# EAGLE design Itchycoo Tape Flanger (EAGLE 9.5.2)

## Sheet 1 of 3
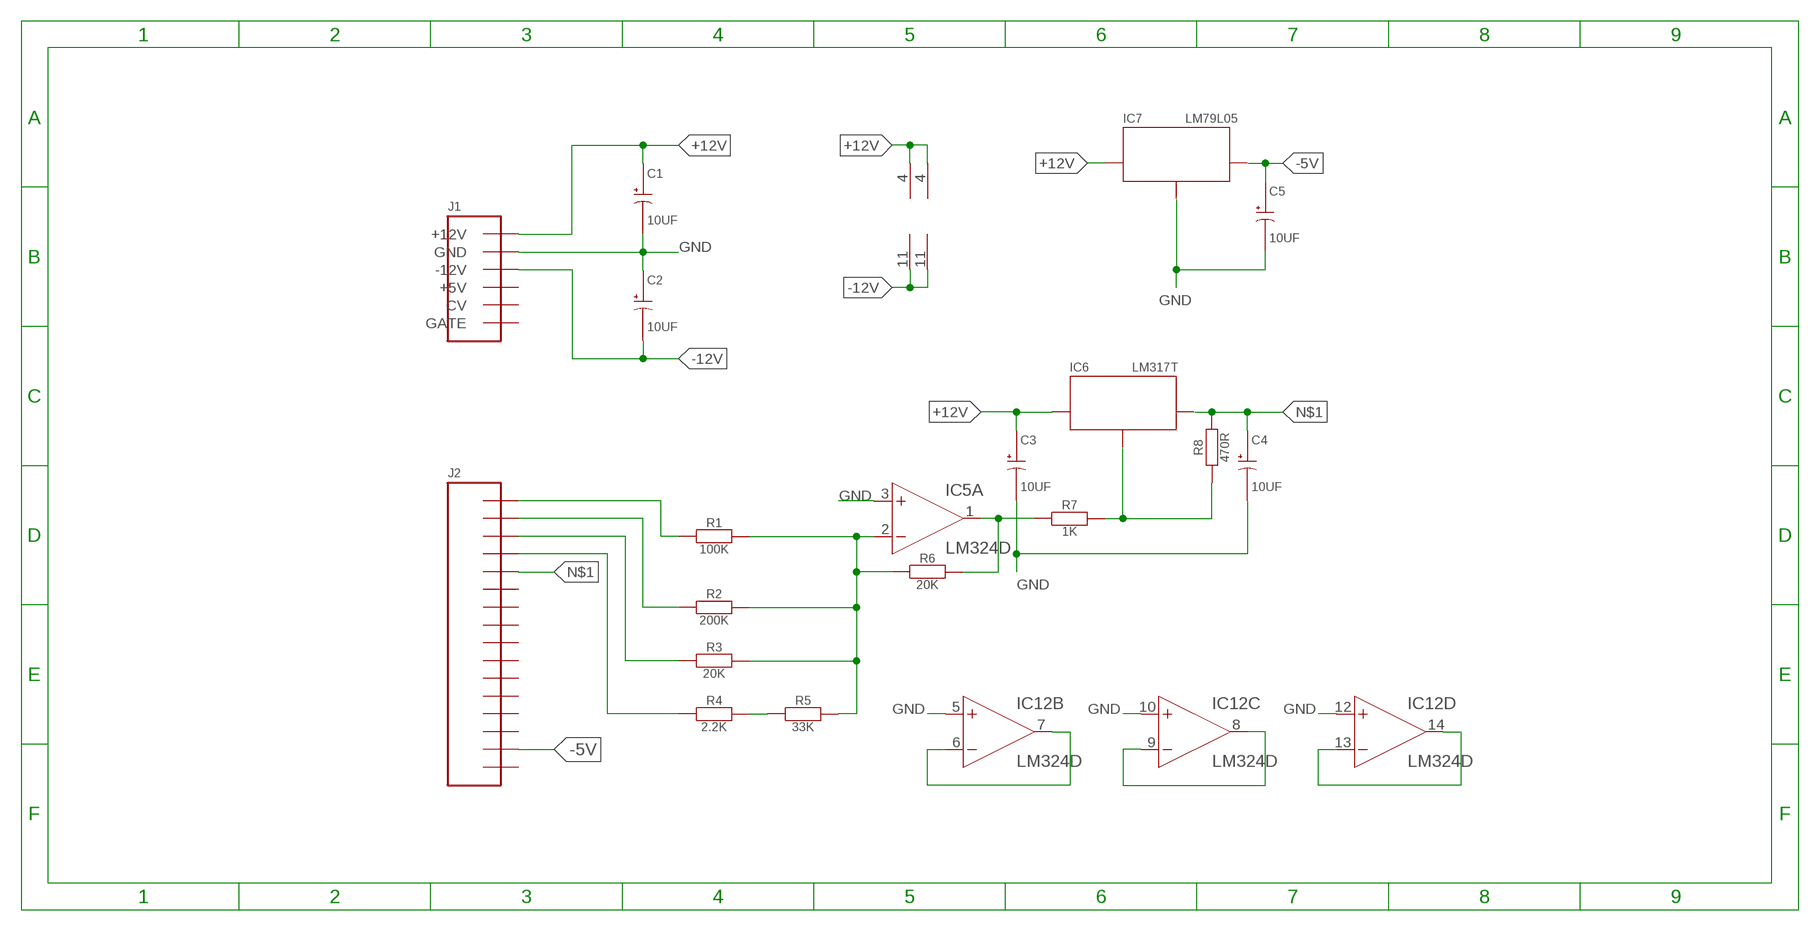
[diagram p0: schematic, sheet 1]

### Parts
C1  10UF  C+  [PANASONIC_E]
C2  10UF  C+  [PANASONIC_E]
C3  10UF  C+  [PANASONIC_E]
C4  10UF  C+  [PANASONIC_E]
C5  10UF  C+  [PANASONIC_E]
IC5  LM324D  [SO14]
IC6  LM317T  VREG  [SOIC8]
IC7  LM79L05  VREG  [SOIC8]
IC12  LM324D  [SO14]
J1  EURO  [2X08SMT]
J2  CON_16  [2X08SMT]
R1  100K  R  [R6332W]
R2  200K  R  [R6332W]
R3  20K  R  [R6332W]
R4  2.2K  R  [R6332W]
R5  33K  R  [R6332W]
R6  20K  R  [R6332W]
R7  1K  R  [R6332W]
R8  470R  R  [R6332W]

### Nets
+12V: C1.+ C3.+ IC5.4(P:V+) IC6.8(IN) IC7.8(IN) IC12.4(P:V+) J1.9(+12V) J1.10(+12V) ; also sheet 2,3
-5V: C5.+ IC7.1(OUT) J2.15
-12V: C2.- IC5.11(P:V-) IC12.11(P:V-) J1.1(-12V) J1.2(-12V) ; also sheet 2,3
GND: C1.- C2.+ C3.- C4.- C5.- IC5.3(A:+IN) IC7.2(GND) IC7.3(GND) IC7.6(GND) IC7.7(GND) IC12.5(B:+IN) IC12.10(C:+IN) IC12.12(D:+IN) J1.3(GND) J1.4(GND) J1.5(GND) J1.6(GND) J1.7(GND) J1.8(GND) ; also sheet 2,3
N$1: C4.+ IC6.1(OUT) J2.5 R8.2
N$3: J2.4 R4.1
N$4: J2.3 R3.1
N$5: R4.2 R5.1
N$6: IC5.2(A:-IN) R1.2 R2.2 R3.2 R5.2 R6.1
N$8: IC5.1(A:OUT) R6.2 R7.1
N$10: IC6.2(GND) IC6.3(GND) IC6.6(GND) IC6.7(GND) R7.2 R8.1
N$13: IC12.8(C:OUT) IC12.9(C:-IN)
N$19: J2.2 R2.1
N$20: IC12.6(B:-IN) IC12.7(B:OUT)
N$23: IC12.13(D:-IN) IC12.14(D:OUT)
N$27: J2.1 R1.1
Unconnected: IC5.5(B:+IN) IC5.6(B:-IN) IC5.7(B:OUT) IC5.8(C:OUT) IC5.9(C:-IN) IC5.10(C:+IN) IC5.12(D:+IN) IC5.13(D:-IN) IC5.14(D:OUT) IC12.1(A:OUT) IC12.2(A:-IN) IC12.3(A:+IN) J1.11(+5V) J1.12(+5V) J1.13(CV) J1.14(CV) J1.15(GATE) J1.16(GATE) J2.6 J2.7 J2.8 J2.9 J2.10 J2.11 J2.12 J2.13 J2.14 J2.16

## Sheet 2 of 3
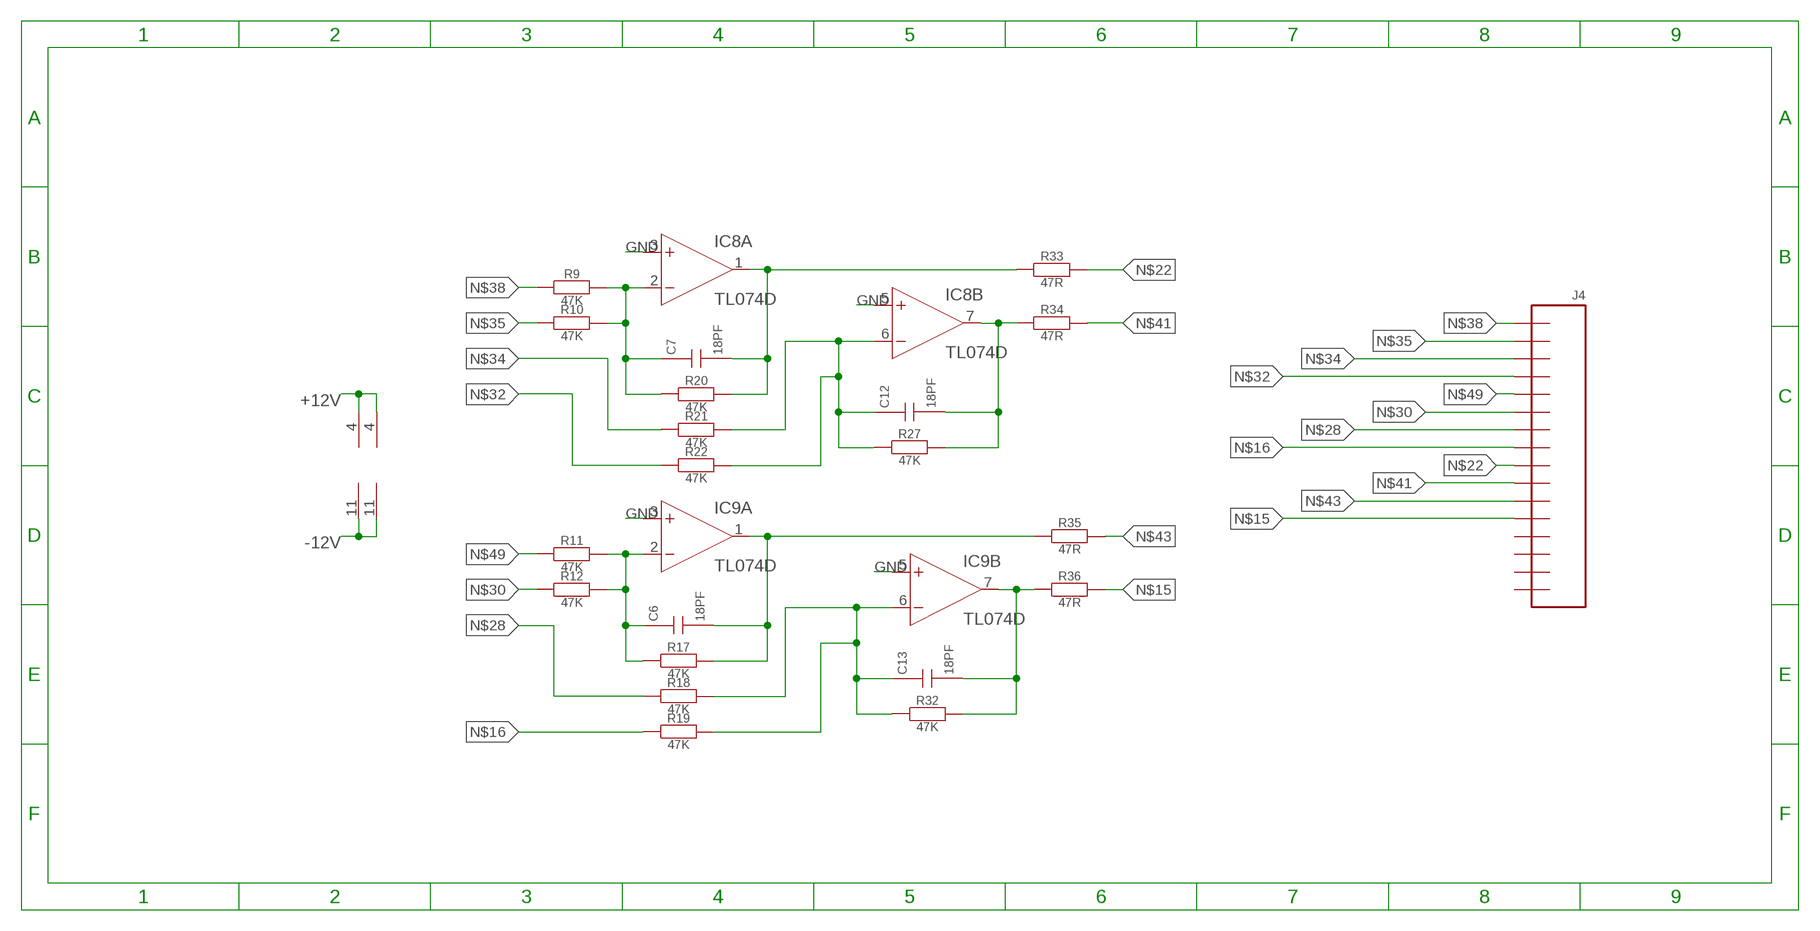
[diagram p1: schematic, sheet 2]

### Parts
C6  18PF  C  [CT6032]
C7  18PF  C  [CT6032]
C12  18PF  C  [CT6032]
C13  18PF  C  [CT6032]
IC8  TL074D  [SO14]
IC9  TL074D  [SO14]
J4  CON_16  [2X08SMT]
R9  47K  R  [R6332W]
R10  47K  R  [R6332W]
R11  47K  R  [R6332W]
R12  47K  R  [R6332W]
R17  47K  R  [R6332W]
R18  47K  R  [R6332W]
R19  47K  R  [R6332W]
R20  47K  R  [R6332W]
R21  47K  R  [R6332W]
R22  47K  R  [R6332W]
R27  47K  R  [R6332W]
R32  47K  R  [R6332W]
R33  47R  R  [R6332W]
R34  47R  R  [R6332W]
R35  47R  R  [R6332W]
R36  47R  R  [R6332W]

### Nets
+12V: IC8.4(P:V+) IC9.4(P:V+) ; also sheet 1,3
-12V: IC8.11(P:V-) IC9.11(P:V-) ; also sheet 1,3
GND: IC8.3(A:+IN) IC8.5(B:+IN) IC9.3(A:+IN) IC9.5(B:+IN) ; also sheet 1,3
N$15: J4.12 R36.2
N$16: J4.8 R19.1
N$22: J4.9 R33.2
N$28: J4.7 R18.1
N$30: J4.6 R12.1
N$32: J4.4 R22.1
N$34: J4.3 R21.1
N$35: J4.2 R10.1
N$36: C7.+ IC8.2(A:-IN) R9.2 R10.2 R20.1
N$37: C7.- IC8.1(A:OUT) R20.2 R33.1
N$38: J4.1 R9.1
N$39: C12.- IC8.7(B:OUT) R27.2 R34.1
N$41: J4.10 R34.2
N$43: J4.11 R35.2
N$49: J4.5 R11.1
N$55: C12.+ IC8.6(B:-IN) R21.2 R22.2 R27.1
N$56: C6.+ IC9.2(A:-IN) R11.2 R12.2 R17.1
N$57: C6.- IC9.1(A:OUT) R17.2 R35.1
N$94: C13.- IC9.7(B:OUT) R32.2 R36.1
N$105: C13.+ IC9.6(B:-IN) R18.2 R19.2 R32.1
Unconnected: IC8.8(C:OUT) IC8.9(C:-IN) IC8.10(C:+IN) IC8.12(D:+IN) IC8.13(D:-IN) IC8.14(D:OUT) IC9.8(C:OUT) IC9.9(C:-IN) IC9.10(C:+IN) IC9.12(D:+IN) IC9.13(D:-IN) IC9.14(D:OUT) J4.13 J4.14 J4.15 J4.16

## Sheet 3 of 3
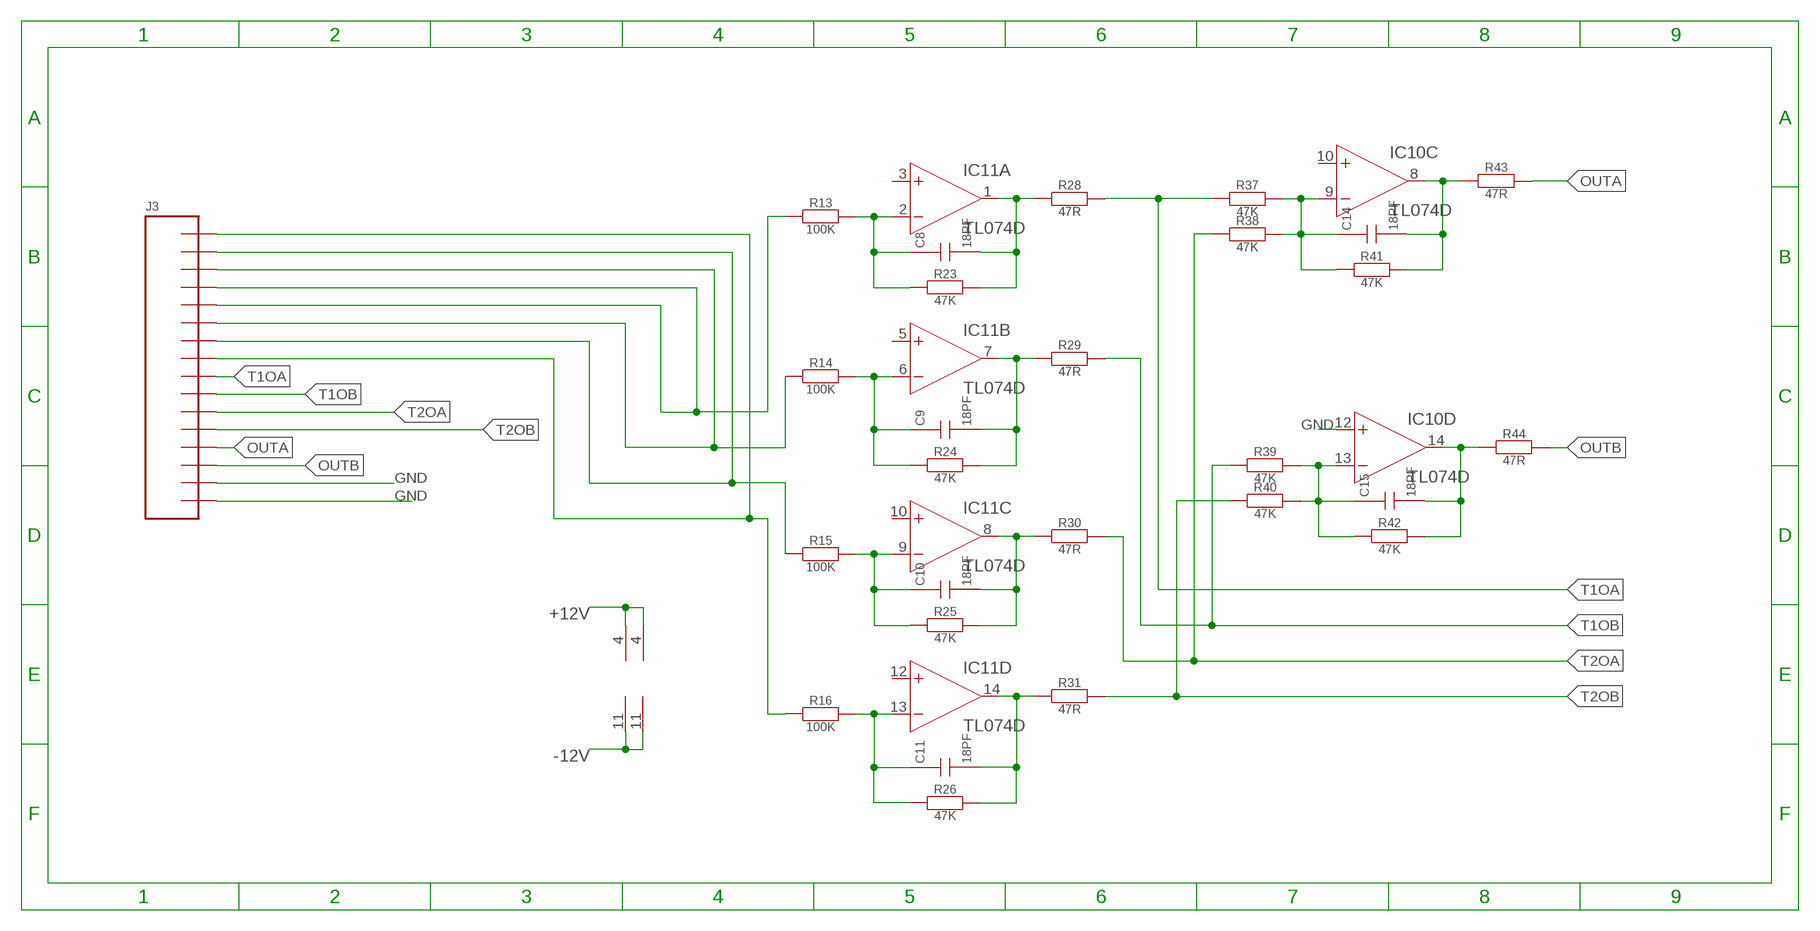
[diagram p2: schematic, sheet 3]

### Parts
C8  18PF  C  [CT6032]
C9  18PF  C  [CT6032]
C10  18PF  C  [CT6032]
C11  18PF  C  [CT6032]
C14  18PF  C  [CT6032]
C15  18PF  C  [CT6032]
IC10  TL074D  [SO14]
IC11  TL074D  [SO14]
J3  CON_16  [2X08SMT]
R13  100K  R  [R6332W]
R14  100K  R  [R6332W]
R15  100K  R  [R6332W]
R16  100K  R  [R6332W]
R23  47K  R  [R6332W]
R24  47K  R  [R6332W]
R25  47K  R  [R6332W]
R26  47K  R  [R6332W]
R28  47R  R  [R6332W]
R29  47R  R  [R6332W]
R30  47R  R  [R6332W]
R31  47R  R  [R6332W]
R37  47K  R  [R6332W]
R38  47K  R  [R6332W]
R39  47K  R  [R6332W]
R40  47K  R  [R6332W]
R41  47K  R  [R6332W]
R42  47K  R  [R6332W]
R43  47R  R  [R6332W]
R44  47R  R  [R6332W]

### Nets
+12V: IC10.4(P:V+) IC11.4(P:V+) ; also sheet 1,2
-12V: IC10.11(P:V-) IC11.11(P:V-) ; also sheet 1,2
GND: IC10.12(D:+IN) J3.15 J3.16 ; also sheet 1,2
N$9: J3.4 J3.5 R13.1
N$26: C8.- IC11.1(A:OUT) R23.2 R28.1
N$31: J3.3 J3.6 R14.1
N$33: J3.2 J3.7 R15.1
N$42: J3.1 J3.8 R16.1
N$54: C9.+ IC11.6(B:-IN) R14.2 R24.1
N$61: C9.- IC11.7(B:OUT) R24.2 R29.1
N$69: C10.+ IC11.9(C:-IN) R15.2 R25.1
N$70: C10.- IC11.8(C:OUT) R25.2 R30.1
N$74: C11.- IC11.14(D:OUT) R26.2 R31.1
N$98: C11.+ IC11.13(D:-IN) R16.2 R26.1
N$100: C8.+ IC11.2(A:-IN) R13.2 R23.1
N$101: C14.+ IC10.9(C:-IN) R37.2 R38.2 R41.1
N$102: C14.- IC10.8(C:OUT) R41.2 R43.1
N$104: C15.+ IC10.13(D:-IN) R39.2 R40.2 R42.1
N$106: C15.- IC10.14(D:OUT) R42.2 R44.1
OUTA: J3.13 R43.2
OUTB: J3.14 R44.2
T1OA: J3.9 R28.2 R37.1
T1OB: J3.10 R29.2 R39.1
T2OA: J3.11 R30.2 R38.1
T2OB: J3.12 R31.2 R40.1
Unconnected: IC10.1(A:OUT) IC10.2(A:-IN) IC10.3(A:+IN) IC10.5(B:+IN) IC10.6(B:-IN) IC10.7(B:OUT) IC10.10(C:+IN) IC11.3(A:+IN) IC11.5(B:+IN) IC11.10(C:+IN) IC11.12(D:+IN)

## Library data of the parts
C1-C5 = SMD:C+
C6-C15 = SMD:C
IC5 IC12 = SMD:LM324: OP AMP
IC6 IC7 = SMD:VREG
IC8-IC11 = SMD:TL074: OP AMP
J1 = SMD:EURO; SPICEPREFIX: X
J2-J4 = SMD:CON_16
R1-R44 = SMD:R

## Board
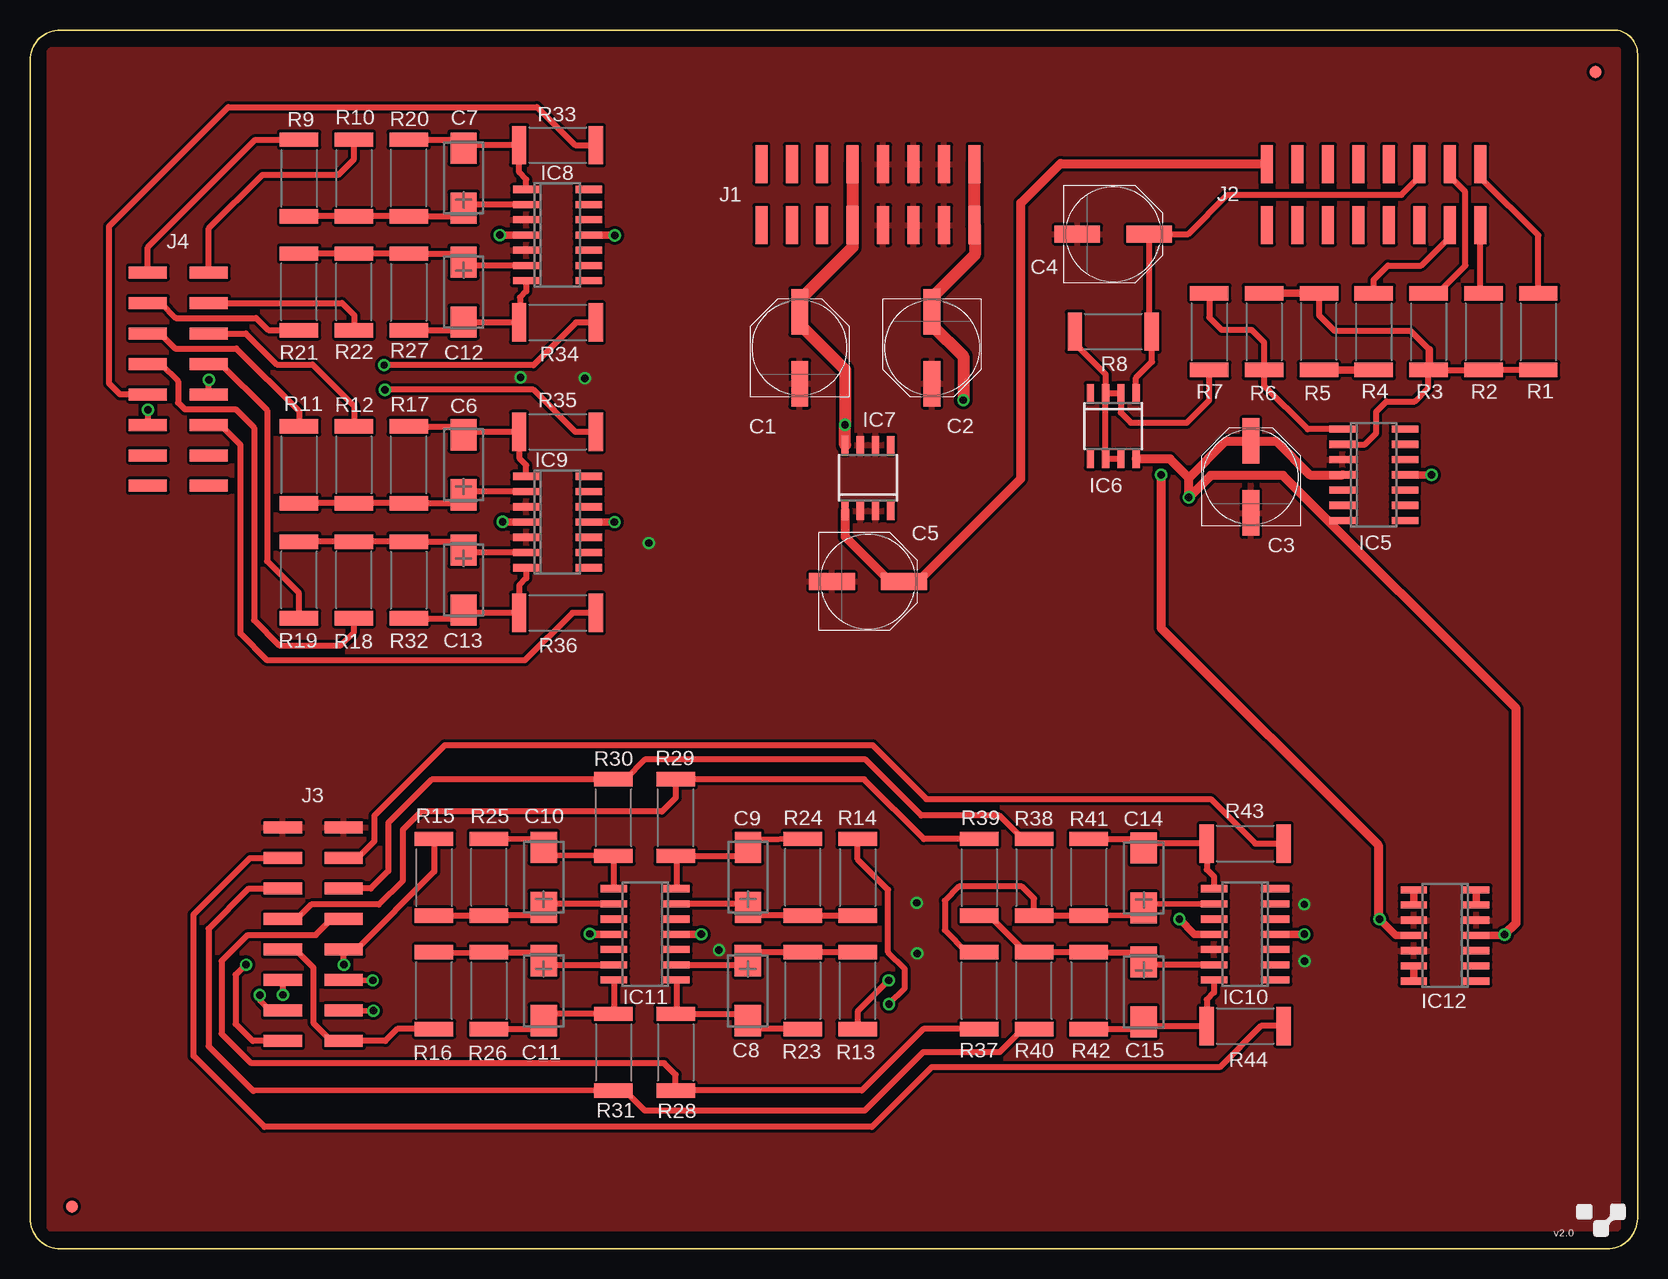
[diagram p3: board, top side]
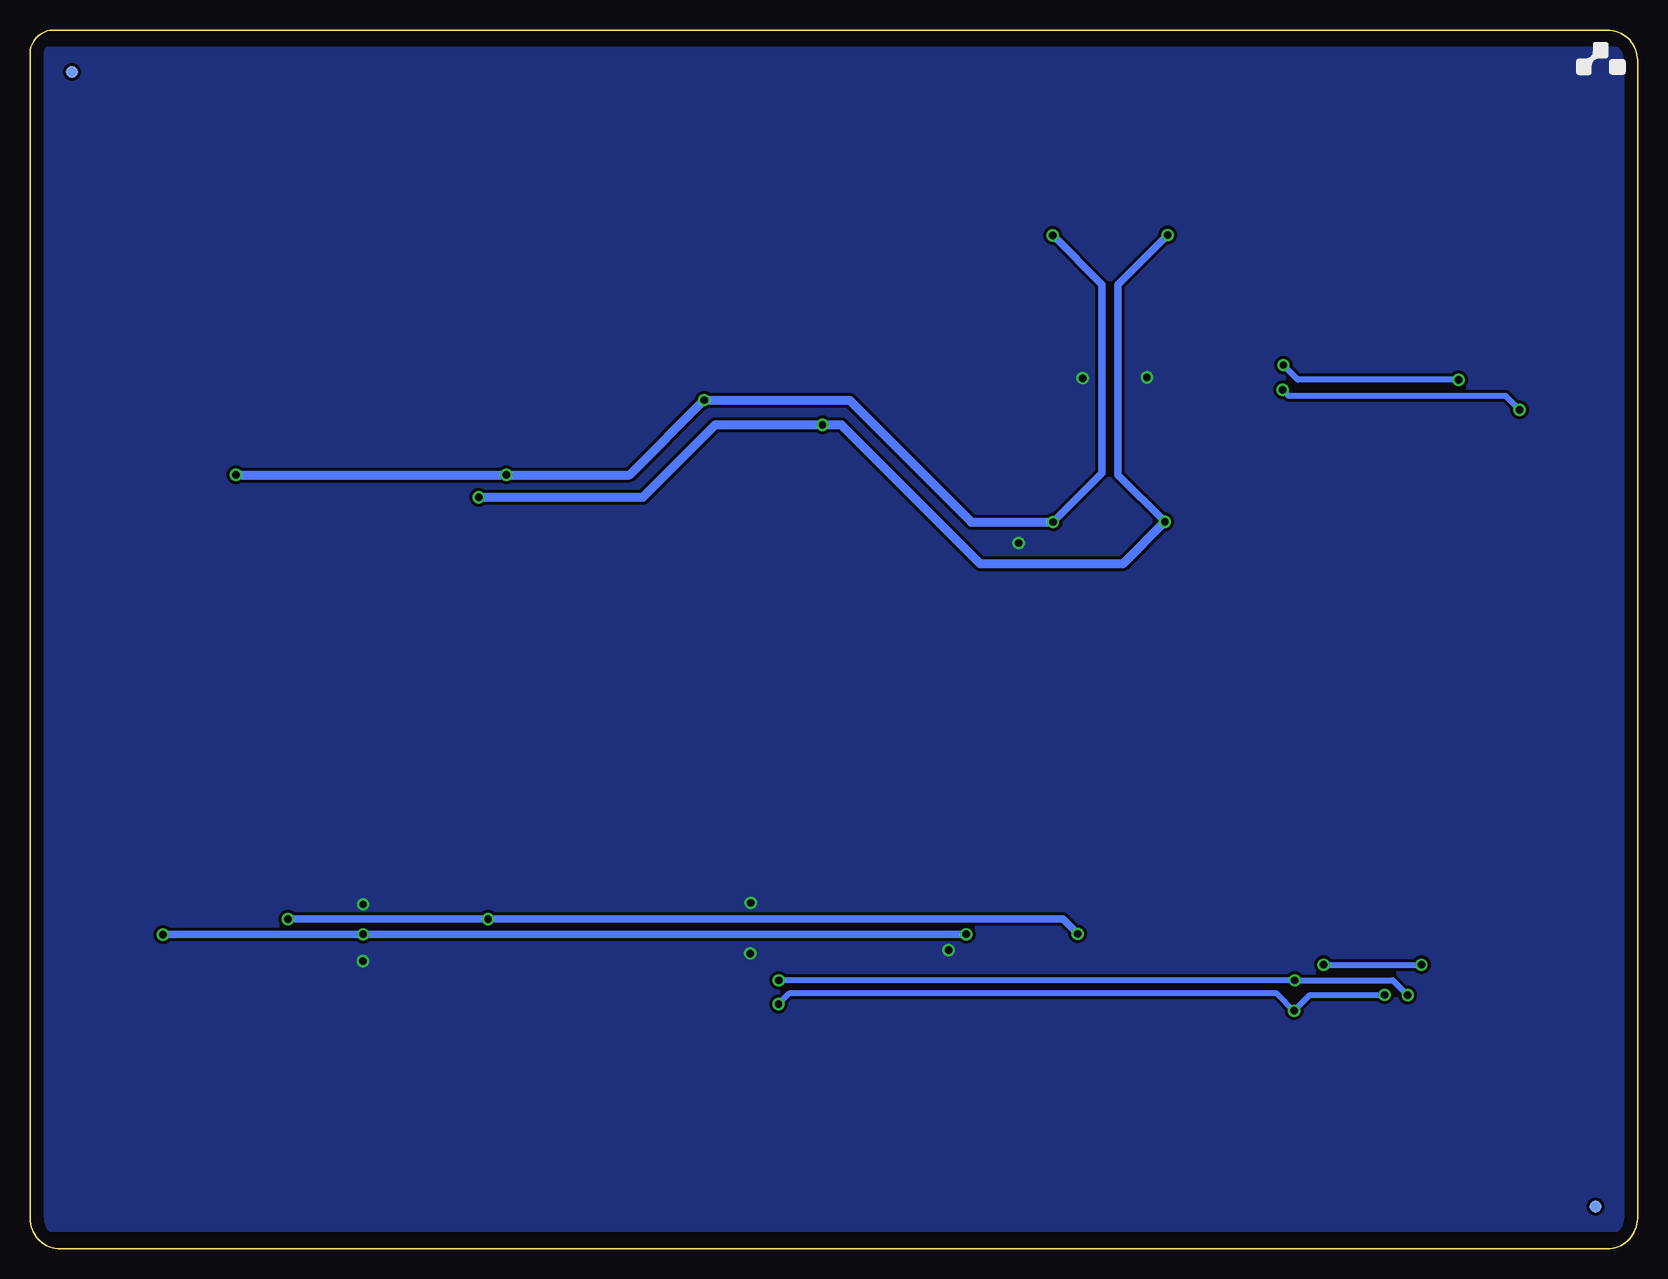
[diagram p4: board, bottom side, seen from below]

Size 134 x 101.6 mm. Coordinates in mm from the lower left corner, seen from the top.
Copper layers (1*16): Top 0.035mm / dielectric 1.5mm / Bottom 0.035mm
Design rules "default *": minimum track width 10mil, minimum drill 24mil, track to track 10mil, track to pad 10mil, pad to pad 10mil, via to via 10mil, smd to smd 8mil, copper to edge 40mil, drill to drill 8mil, minimum pad ring 10mil, minimum via ring 8mil, stop-mask expansion 4mil, vias tented up to drill 0mil, thermal gap 10mil

### Footprints (pad centres in the part's own frame; a part is rotated, then mirrored left to right if it is on the bottom)
PANASONIC_E = smd 3.8 x 1.4: + 3,0; - -3,0
CT6032 = smd 2.6 x 2.2: + -2.5,0; - 2.5,0
4X5_BOARD_V2 = smd 1 x 1: P$1 130.5,98.1; P$3 3.5,3.5 | smd 1 x 1 bottom: P$2 130.5,98.1; P$4 3.5,3.5
SO14 = smd 0.6 x 2.2: 1 -3.81,-2.6; 2 -2.54,-2.6; 3 -1.27,-2.6; 4 0,-2.6; 5 1.27,-2.6; 6 2.54,-2.6; 7 3.81,-2.6; 8 3.81,2.6; 9 2.54,2.6; 10 1.27,2.6; 11 0,2.6; 12 -1.27,2.6; 13 -2.54,2.6; 14 -3.81,2.6
SOIC8 = smd 0.6 x 1.5: 1 -1.905,-2.75; 2 -0.635,-2.75; 3 0.635,-2.75; 4 1.905,-2.75; 5 1.905,2.75; 6 0.635,2.75; 7 -0.635,2.75; 8 -1.905,2.75
2X08SMT = smd 1 x 3.17: 1 -8.89,-2.54; 2 -8.89,2.54; 3 -6.35,-2.54; 4 -6.35,2.54; 5 -3.81,-2.54; 6 -3.81,2.54; 7 -1.27,-2.54; 8 -1.27,2.54; 9 1.27,-2.54; 10 1.27,2.54; 11 3.81,-2.54; 12 3.81,2.54; 13 6.35,-2.54; 14 6.35,2.54; 15 8.89,-2.54; 16 8.89,2.54
R6332W = smd 1.2 x 3.2: 1 -3.196,0; 2 3.196,0

### Placement (x,y rotation side)
C1  64.16,75.11 90 top
C2  75.18,75.11 270 top
C3  101.78,64.34 90 top
C4  90.3,84.58 0 top
C5  69.85,55.63 0 top
C6  36.14,65.35 90 top
C7  36.14,89.26 90 top
C8  59.84,21.51 270 top
C9  59.85,30.96 90 top
C10  42.82,30.96 90 top
C11  42.82,21.51 270 top
C12  36.14,79.76 270 top
C13  36.14,55.75 270 top
C14  92.84,30.9 90 top
C15  92.84,21.42 270 top
E$1  [4X5_BOARD_V2]  0,0 0 top
IC5  112.01,64.52 270 top
IC6  90.3,68.58 180 top
IC7  69.85,64.26 0 top
IC8  43.97,84.51 270 top
IC9  43.97,60.58 270 top
IC10  101.3,26.21 90 top
IC11  51.28,26.21 90 top
IC12  117.95,26.11 90 top
J1  69.85,87.88 180 top
J2  112.01,87.88 180 top
J3  23.62,26.21 90 top
J4  12.37,72.49 270 top
R1  125.73,76.45 270 top
R2  121.16,76.45 270 top
R3  116.59,76.45 270 top
R4  112.01,76.45 270 top
R5  107.44,76.45 90 top
R6  102.87,76.45 270 top
R7  98.3,76.45 270 top
R8  90.3,76.45 0 top
R9  22.43,89.26 270 top
R10  27,89.26 270 top
R11  22.43,65.35 270 top
R12  27,65.35 270 top
R13  68.99,21.51 90 top
R14  68.99,30.96 270 top
R15  33.68,30.96 270 top
R16  33.68,21.51 90 top
R17  31.57,65.35 90 top
R18  27,55.75 90 top
R19  22.43,55.75 90 top
R20  31.57,89.26 90 top
R21  22.43,79.76 90 top
R22  27,79.76 90 top
R23  64.41,21.51 270 top
R24  64.41,30.96 90 top
R25  38.25,30.96 90 top
R26  38.25,21.51 270 top
R27  31.57,79.76 270 top
R28  53.82,16.38 270 top
R29  53.82,35.94 90 top
R30  48.64,35.94 90 top
R31  48.64,16.38 270 top
R32  31.57,55.75 270 top
R33  43.97,92 0 top
R34  43.97,77.22 0 top
R35  43.97,68.1 0 top
R36  43.97,53.01 0 top
R37  79.12,21.51 90 top
R38  83.69,30.96 270 top
R39  79.12,30.96 270 top
R40  83.69,21.51 90 top
R41  88.27,30.96 90 top
R42  88.27,21.51 270 top
R43  101.3,33.77 0 top
R44  101.3,18.57 0 top

### Tracks (layer width: path | path; a pad name or v marks a point on that pad's centre or on a via)
+12V  (via drill 0.61)
  Top 0.61: IC11.4 v55.96,26.21 | v106.22,26.21 IC10.4 | IC8.4 v39.17,84.51 | v39.4,60.6 39.42,60.58 IC9.4 | v122.91,26.19 122.84,26.11 IC12.4
  Top 0.762: C1.+ 64.16,77.06 | IC5.4 106.7,64.52 103.88,67.34 C3.+ 101.75,67.31 99.64,67.31 96.6,64.26 | v122.91,26.19 123.88,27.15 123.88,45.03 104.44,64.47 98.42,64.47 v96.6,62.64 96.6,64.26 | 96.6,64.26 95.03,65.83 IC6.8
  Top 1.016: J1.9 J1.10 68.58,83.52 64.16,79.1 C1.+ | 64.16,77.06 67.94,73.28 v67.94,68.68 IC7.8
  Bottom 0.61: v55.96,26.21 v106.22,26.21 122.89,26.21 v122.91,26.19 | v39.17,84.51 43.31,80.37 43.31,64.52 v39.4,60.6
  Bottom 0.762: v39.4,60.6 42.9,57.1 54.79,57.1 66.37,68.68 v67.94,68.68 76.89,68.68 82.93,62.64 v96.6,62.64
-5V
  Top 0.762: IC7.1 67.94,59.36 71.68,55.63 C5.+ 74.04,55.63 82.6,64.19 82.6,87.17 85.9,90.47 103.07,90.47 J2.15
-12V  (via drill 0.61)
  Top 0.61: IC11.11 46.69,26.21 v46.66,26.24 | v95.81,27.48 97.08,26.21 IC10.11 | IC9.11 v48.72,60.58 | v48.74,84.48 48.72,84.51 IC8.11 | IC12.11 113.86,26.11 v112.5,27.48 | v116.84,64.52 IC5.11
  Top 0.762: C2.- 75.18,77.01 | v112.5,27.48 112.39,27.58 112.39,33.66 94.28,51.77 v94.28,64.52
  Top 1.016: J1.1 J1.2 78.77,85.32 78.77,82.86 75.18,79.27 C2.- | 75.18,77.01 77.8,74.4 v77.8,70.74
  Bottom 0.61: v46.66,26.24 47.9,27.48 v95.81,27.48 v112.5,27.48 | v48.72,60.58 44.63,64.67 44.63,80.37 v48.74,84.48
  Bottom 0.762: v48.72,60.58 55.52,60.58 65.68,70.74 v77.8,70.74 84.02,64.52 v94.28,64.52 v116.84,64.52
GND  (via drill 0.61)
  other vias: 106.22,28.7 57.43,24.89 73.91,28.83 73.96,24.61 51.59,58.83 40.89,72.64 46.25,72.57 106.25,23.98
  pour Top: 1.65,1.65 1.65,99.95 132.36,99.95 132.36,1.65
  pour Bottom: 1.19,1.65 1.19,99.95 132.79,99.95 132.79,1.65
N$1
  Top 0.508: 93.3,76.65 C4.+ 96.55,84.58 99.82,87.86 114.33,87.86 115.7,89.23 | IC6.1 92.2,72.62 93.52,73.94 93.52,76.42
  Top 0.61: 93.3,76.65 R8.2 93.52,76.42 | 115.7,89.23 115.7,90.3 J2.5
N$3
  Top 0.508: R4.1 112.01,80.77 113.21,81.97 115.98,81.97 118.34,84.33
  Top 0.61: 118.34,84.33 118.34,85.32 J2.4
N$4
  Top 0.508: 118.52,89.23 119.63,88.11 119.66,81.97 117.35,79.65
  Top 0.61: R3.1 117.35,79.65 | 118.52,89.23 118.52,90.27 J2.3
N$5
  Top 0.61: R5.1 R4.2
N$6
  Top 0.508: R1.2 R2.2 R3.2 | R5.2 107.44,77.83 108.74,76.53 115.06,76.53 116.64,74.95 | IC5.2 111.28,67.06 112.22,68 112.22,69.77 113.08,70.64 115.42,70.64 116.56,71.78 116.56,73.23
  Top 0.61: R6.1 R5.2 | 116.64,74.95 116.64,73.31 R3.2 116.56,73.23
N$8
  Top 0.508: IC5.1 106.5,68.33 102.87,71.96 R6.2 102.87,75.56 101.83,76.61 99.31,76.61 98.3,77.62 R7.1
N$9  (via drill 0.61)
  Top 0.508: J3.5 v28.57,22.37 v28.57,22.38 | v19.16,21.14 19.16,20.72 20.09,19.79 21.04,19.79 J3.4 | v71.58,22.38 68.99,19.79 R13.1
  Bottom 0.508: v19.16,21.14 20.4,22.38 v28.57,22.38 v71.58,22.38
N$10
  Top 0.508: IC6.3 89.66,72.9 87.1,75.46 R8.1 | IC6.3 IC6.6 IC6.7 | IC6.3 IC6.2 90.93,69.7 91.77,68.86 96.42,68.86 98.3,70.74 R7.2
N$13
  Top 0.61: IC12.8 IC12.9
N$15
  Top 0.508: R36.2 45.21,53.01 41.25,49.05 19.79,49.05 17.55,51.28 17.55,67 15.88,68.68 J4.12
N$16
  Top 0.508: R19.1 22.43,54.66 19.76,57.33 19.76,69.9 15.9,73.76 J4.8
N$19
  Top 0.508: 120.9,79.9 J2.2
  Top 0.61: R2.1 120.9,79.9
N$20
  Top 0.61: IC12.7 IC12.6
N$22
  Top 0.508: J4.9 7.52,71.22 6.6,72.14 6.6,85.24 16.54,95.17 42.27,95.17 45.44,92 R33.2
N$23
  Top 0.61: IC12.13 IC12.14
N$26
  Top 0.508: IC11.1 53.88,19.62 R28.1 59.3,19.58 C8.- 60.54,18.32 R23.2
N$27
  Top 0.508: R1.1 125.73,84.48 120.9,89.31
  Top 0.61: 120.9,89.31 J2.1
N$28
  Top 0.508: J4.7 10.9,73.76 12.34,72.31 12.34,70.54 12.9,69.98 17.14,69.98 18.67,68.45 18.67,52.4 20.78,50.29 25.91,50.29 27,51.38 R18.1
N$30
  Top 0.508: J4.6 17.98,76.3 20.57,73.71 23.55,73.71 27,70.26 R12.1
N$31  (via drill 0.61)
  Top 0.508: J3.3 v28.62,19.83 v28.63,19.84 | J3.6 v21.08,21.16 | v71.6,20.4 72.92,21.72 72.92,23.32 71.53,24.71 71.53,29.92 68.99,32.46 R14.1
  Bottom 0.508: v21.08,21.16 27.3,21.16 v28.63,19.84 30.07,21.29 70.71,21.29 v71.6,20.4
N$32
  Top 0.508: J4.4 26.01,78.84 27.03,77.83 27.03,76.58 R22.1
N$33  (via drill 0.61)
  Top 0.508: R15.1 33.7,31.44 27.18,24.91 J3.7 v26.16,23.67 | J3.2 18.57,17.32 17.14,18.75 17.14,22.84 17.98,23.67 v18.01,23.67 | v26.16,23.67
  Bottom 0.508: v26.16,23.67 v18.01,23.67
N$34
  Top 0.508: J4.3 10.92,78.84 12.17,77.6 18.85,77.6 19.86,76.58 22.41,76.58 R21.1
N$35
  Top 0.508: J4.2 14.91,85.06 19.36,89.51 25.68,89.51 27,90.83 R10.1
N$36
  Top 0.508: IC8.2 36.43,87.05 C7.+ 35.45,86.06 R20.1 R10.2 R9.2
N$37
  Top 0.508: IC8.1 41.37,89.14 40.77,89.73 R33.1 36.39,92 C7.- 35.45,92.45 R20.2
N$38
  Top 0.508: J4.1 9.83,83.49 18.79,92.45 R9.1
N$39
  Top 0.508: IC8.7 41.37,79.82 40.84,79.3 40.84,77.29 R34.1 36.18,77.22 | 36.18,77.22 C12.- | R27.2 35.53,76.56 36.18,77.22
N$41  (via drill 0.61)
  Top 0.508: R34.2 45.52,77.22 41.96,73.66 v29.52,73.66 | J4.10 v14.91,72.44
  Bottom 0.508: v14.91,72.44 28.3,72.44 v29.52,73.66
N$42
  Top 0.508: R16.1 30.61,18.32 29.62,17.32 J3.1 25.16,17.29 23.62,18.83 23.62,23.45 22.16,24.91 J3.8
N$43  (via drill 0.61)
  Top 0.508: R35.2 45.47,68.1 41.96,71.6 v29.59,71.6 | v9.83,69.93 J4.11
  Bottom 0.508: v9.83,69.93 11,71.09 29.08,71.09 v29.59,71.6
N$49
  Top 0.508: J4.5 10.85,76.3 12.09,75.06 17.2,75.06 22.43,69.83 R11.1
N$54
  Top 0.508: R14.2 R24.1 60.54,27.78 C9.+ 59.61,28.46 59.32,28.75 IC11.6
N$55
  Top 0.508: IC8.6 36.43,81.97 C12.+ 35.45,82.95 R27.1 R22.2 R21.2
N$56
  Top 0.508: IC9.2 36.41,63.12 C6.+ 35.45,62.16 R17.1 R12.2 R11.2
N$57
  Top 0.508: IC9.1 41.37,65.31 40.82,65.86 40.82,68.05 R35.1 36.39,68.1 C6.- 35.45,68.55 R17.2
N$61
  Top 0.508: IC11.7 53.88,32.7 R29.1 59.13,32.74 C9.- 60.51,34.06 R24.2
N$69
  Top 0.508: IC11.9 43.06,28.75 C10.+ 42.09,27.78 R25.1 R15.2 33.15,27.76
N$70
  Top 0.508: R25.2 38.28,34.13 41.98,34.14 C10.- 43.37,32.75 48.62,32.77 R30.1 48.68,32.71 IC11.8
N$74
  Top 0.508: R26.2 42.14,18.32 C11.- 42.84,19.01 43.41,19.58 R31.1 48.68,19.59 IC11.14
N$94
  Top 0.508: IC9.7 41.37,55.9 40.77,55.3 R36.1 36.39,53.01 C13.- 35.45,52.56 R32.2
N$98
  Top 0.508: R16.2 38.1,24.66 R26.1 42.04,24.7 C11.+ 43.06,23.67 IC11.13
N$100
  Top 0.508: IC11.2 59.5,23.67 C8.+ 60.54,24.71 R23.1 R13.2
N$101
  Top 0.508: IC10.9 93.17,28.72 C14.+ 92.23,27.78 R41.1 R38.2 83.69,29.18 82.68,30.2 77.44,30.2 76.25,29.01 76.25,26.57 78.11,24.71 R37.2
N$102
  Top 0.508: IC10.8 98.69,31.02 98.1,31.62 R43.1 93.22,33.77 C14.- 92.09,34.17 R41.2
N$104
  Top 0.508: IC10.13 93.06,23.67 92.84,23.9 C15.+ 92.08,24.7 R42.1 R40.2 83.04,24.71 79.98,27.77 R39.2
N$105
  Top 0.508: IC9.6 36.36,58.04 C13.+ 35.45,58.95 R32.1 R18.2 R19.2
N$106
  Top 0.508: IC10.14 98.69,21.35 98.1,20.76 R44.1 93.15,18.57 92.84,18.88 C15.- 92.23,18.32 R42.2
OUTA
  Top 0.508: J3.13 27.3,32.56 28.73,33.98 28.73,36.12 34.59,41.99 70.23,41.99 74.73,37.49 98.42,37.49 102.14,33.77 R43.2
OUTB
  Top 0.508: R44.2 102.62,18.57 99.19,15.14 75.16,15.14 70.18,10.16 19.56,10.16 13.64,16.08 13.64,27.86 18.34,32.56 J3.14
T1OA
  Top 0.508: J3.9 26.69,27.45 26.72,27.48 25.15,27.48 23.82,26.16 18.16,26.16 15.98,23.98 15.98,17.93 18.44,15.47 52.86,15.47 53.82,14.51 R28.2 69.35,13.19 74.48,18.32 R37.1
T1OB
  Top 0.508: J3.10 22.19,27.45 23.44,28.7 29.08,28.7 31.06,30.68 31.06,34.92 32.59,36.45 52.68,36.45 53.82,37.59 R29.2 69.52,39.14 74.5,34.16 R39.1
T2OA
  Top 0.508: J3.11 28.41,30.02 29.87,31.49 29.87,35.5 33.49,39.12 R30.2 49.63,39.14 51.26,40.77 69.65,40.77 74.3,36.12 80.8,36.12 82.76,34.16 R38.1
T2OB
  Top 0.508: J3.12 18.24,30.02 14.88,26.67 14.88,16.89 18.62,13.16 R31.2 49.58,13.19 51.26,11.51 69.57,11.51 74.45,16.38 80.82,16.38 82.76,18.32 R40.1